# Altium schematic sheet Master Schematic.SchDoc
size A
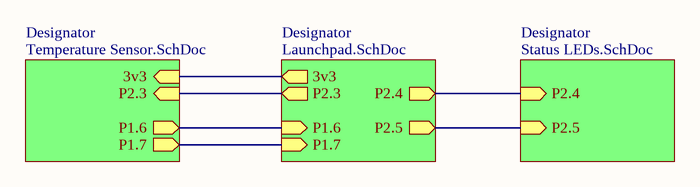
[diagram p0: Master Schematic.SchDoc]

## Sub-sheets
Designator = Status LEDs.SchDoc: P2.4 (in), P2.5 (in)
Designator = Temperature Sensor.SchDoc: 3v3 (in), P2.3 (in), P1.6 (out), P1.7 (out)
Designator = Launchpad.SchDoc: 3v3 (out), P2.3 (out), P1.6 (in), P1.7 (in), P2.5 (out), P2.4 (out)

## Nets
(unnamed): sheet Designator/P2.4, sheet Designator/P2.4
(unnamed): sheet Designator/P2.5, sheet Designator/P2.5
(unnamed): sheet Designator/3v3, sheet Designator/3v3
(unnamed): sheet Designator/P2.3, sheet Designator/P2.3
(unnamed): sheet Designator/P1.6, sheet Designator/P1.6
(unnamed): sheet Designator/P1.7, sheet Designator/P1.7